# EAGLE schematic ESP_CO2_V0.30 (EAGLE 9.6.2)
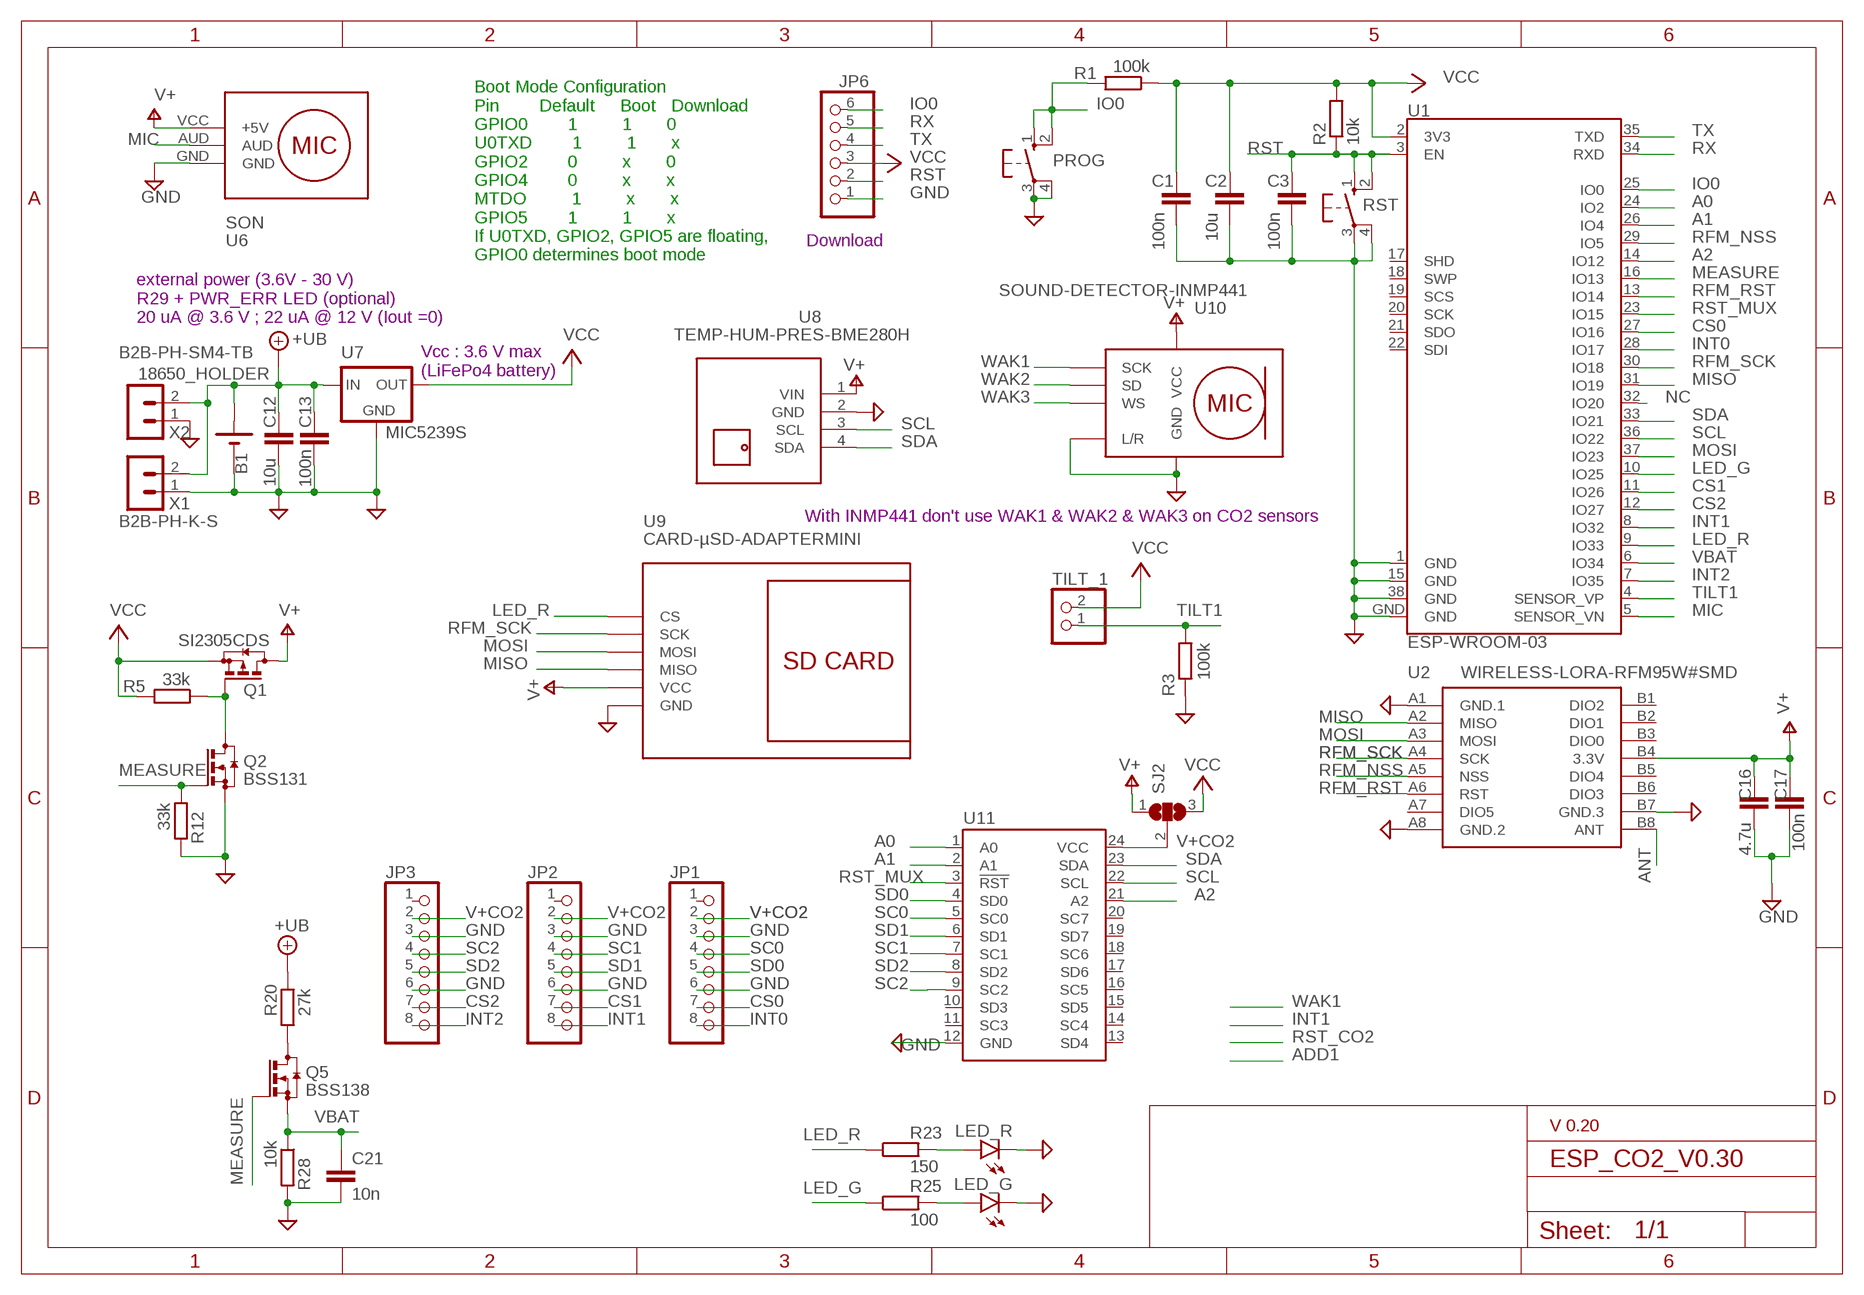
[diagram p0: schematic, sheet 1]

## Parts
B1  18650_HOLDER  [18650]
C1  100n  CC1206  [C1206]
C2  10u  CC1206  [C1206]
C3  100n  CC1206  [C1206]
C12  10u  CC1206  [C1206]
C13  100n  CC1206  [C1206]
C16  4.7u  CC1206  [C1206]
C17  100n  CC1206  [C1206]
C21  10n  CC1206  [C1206]
JP1  PINHD-1X8  [1X08]
JP2  PINHD-1X8  [1X08]
JP3  PINHD-1X8  [1X08]
JP6  PINHD-1X6/90  [1X06/90]
LED_G  LEDSML0805  [SML0805]
LED_R  LEDSML0805  [SML0805]
PROG  10-XX  [B3F-10XX]
Q1  SI2305CDS  [SOT23]
Q2  BSS131  [SOT23]
Q5  BSS138  [SOT23]
R1  100k  RR1206  [R1206]
R2  10k  RR1206  [R1206]
R3  100k  RR1206  [R1206]
R5  33k  RR1206  [R1206]
R12  33k  RR1206  [R1206]
R20  27k  RR1206  [R1206]
R23  150  RR1206  [R1206]
R25  100  RR1206  [R1206]
R28  10k  RR1206  [R1206]
RST  10-XX  [B3F-10XX]
SJ2  SJ2W  [SJ_2]
TILT_1  PINHD-1X2  [1X02]
U1  ESP-WROOM-03  [ESP-WROOM-03]
U2  WIRELESS-LORA-RFM95W#SMD  [WIRELESS-LORA-RFM95W#SMD]
U6  SON  [SON]
U7  MIC5239S  [SOT223]
U8  TEMP-HUM-PRES-BME280H  [TEMP-HUM-PRES-BME280-H]
U9  CARD-µSD-ADAPTERMINI  [CARD-MINI--µSD-READER]
U10  SOUND-DETECTOR-INMP441  [SOUND-DETECTOR-INMP441]
U11  PCA9548A  [TSSOP28]
X1  B2B-PH-K-S  [B2B-PH-K-S]
X2  B2B-PH-SM4-TB  [B2B-PH-SM4-TB]

## Nets
+UB: B1.+ C12.1 C13.1 R20.2 U7.1(IN) X1.2 X2.2
A0: U1.24(IO2) U11.1(A0)
A1: U1.26(IO4) U11.2(A1)
A2: U1.14(IO12) U11.21(A2)
ANT: U2.B8(ANT)
CS0: JP1.7 U1.27(IO16)
CS1: JP2.7 U1.11(IO26)
CS2: JP3.7 U1.12(IO27)
GND: B1.- C1.2 C2.2 C3.2 C12.2 C13.2 C16.2 C17.2 C21.2 JP1.3 JP1.6 JP2.3 JP2.6 JP3.3 JP3.6 JP6.1 LED_G.C LED_R.C PROG.3(P) PROG.4(P1) Q2.2(S) R3.2 R12.2 R28.2 RST.3(P) RST.4(P1) U1.1(GND) U1.15(GND) U1.38(GND) U1.GND U2.A1(GND.1) U2.A8(GND.2) U2.B7(GND.3) U6.GND U7.2(GND) U7.4(GND) U8.2(GND) U9.GND U10.GND U10.L/R U11.12(GND) X1.1 X2.1
INT0: JP1.8 U1.28(IO17)
INT1: JP2.8 U1.8(IO32)
INT2: JP3.8 U1.7(IO35)
IO0: JP6.6 PROG.1(S) PROG.2(S1) R1.2 U1.25(IO0)
LED_G: R25.1 U1.10(IO25)
LED_R: R23.1 U1.9(IO33) U9.CS
MEASURE: Q2.1(G) Q5.1(G) R12.1 U1.16(IO13)
MIC: U1.5(SENSOR_VN) U6.AUD
MISO: U1.31(IO19) U2.A2(MISO) U9.MISO
MOSI: U1.37(IO23) U2.A3(MOSI) U9.MOSI
N$1: Q1.1(G) Q2.3(D) R5.1
N$5: Q5.3(D) R20.1
N$7: LED_R.A R23.2
N$8: LED_G.A R25.2
NC: U1.32(IO20)
RFM_NSS: U1.29(IO5) U2.A5(NSS)
RFM_RST: U1.13(IO14) U2.A6(RST)
RFM_SCK: U1.30(IO18) U2.A4(SCK) U9.SCK
RST: C3.1 JP6.2 R2.1 RST.1(S) RST.2(S1) U1.3(EN)
RST_MUX: U1.23(IO15) U11.3(!RST)
RX: JP6.5 U1.34(RXD)
SC0: JP1.4 U11.5(SC0)
SC1: JP2.4 U11.7(SC1)
SC2: JP3.4 U11.9(SC2)
SCL: U1.36(IO22) U8.3(SCL) U11.22(SCL)
SD0: JP1.5 U11.4(SD0)
SD1: JP2.5 U11.6(SD1)
SD2: JP3.5 U11.8(SD2)
SDA: U1.33(IO21) U8.4(SDA) U11.23(SDA)
TILT1: R3.1 TILT_1.1 U1.4(SENSOR_VP)
TX: JP6.4 U1.35(TXD)
V+: C16.1 C17.1 Q1.3(D) SJ2.1 U2.B4(3.3V) U6.VCC(+5V) U8.1(VIN) U9.VCC U10.VDD(VCC)
V+CO2: JP1.2 JP2.2 JP3.2 SJ2.2 U11.24(VCC)
VBAT: C21.1 Q5.2(S) R28.1 U1.6(IO34)
VCC: C1.1 C2.1 JP6.3 Q1.2(S) R1.1 R2.2 R5.2 SJ2.3 TILT_1.2 U1.2(3V3) U7.3(OUT)
WAK1: U10.SCK
WAK2: U10.SD
WAK3: U10.WS
Unconnected: JP1.1 JP2.1 JP3.1 U1.17(SHD) U1.18(SWP) U1.19(SCS) U1.20(SCK) U1.21(SDO) U1.22(SDI) U2.A7(DIO5) U2.B1(DIO2) U2.B2(DIO1) U2.B3(DIO0) U2.B5(DIO4) U2.B6(DIO3) U11.10(SD3) U11.11(SC3) U11.13(SD4) U11.14(SC4) U11.15(SD5) U11.16(SC5) U11.17(SD6) U11.18(SC6) U11.19(SD7) U11.20(SC7)

## Notes on the sheet
- Download
- Boot Mode Configuration
  Pin        Default     Boot   Download
  GPIO0        1         1       0
  U0TXD        1         1       x
  GPIO2        0         x       0
  GPIO4        0         x       x
  MTDO         1         x       x
  GPIO5        1         1       x
  If U0TXD, GPIO2, GPIO5 are floating, 
  GPIO0 determines boot mode
- external power (3.6V - 30 V)
  R29 + PWR_ERR LED (optional)
  20 uA @ 3.6 V ; 22 uA @ 12 V (Iout =0)
- Vcc : 3.6 V max 
  (LiFePo4 battery)
- With INMP441 don't use WAK1 & WAK2 & WAK3 on CO2 sensors
- V 0.20

## Library data of the parts
B1 = battery_bms:18650_HOLDER: 18650 holder
C1-C3 C12 C13 C16 C17 C21 = eagle-ltspice:C: CAPACITOR, European symbol; SPICEMODEL: NONE; SPICEPREFIX: C
JP1-JP3 = pinhead:PINHD-1X8: PIN HEADER
JP6 = pinhead:PINHD-1X6: PIN HEADER
LED_G LED_R = led:LED: LED OSRAM: - CHIPLED LG R971, LG N971, LY N971, LG Q971, LY Q971, LO R971, LY R971 LH N974, LH R974 LS Q976, LO Q976, LY Q976 LO Q996 - Hyper CHIPLED LW Q18S LB Q993, LB Q99A, LB R99A - SideLED LS A670, LO A670, LY A670, LG A670, LP A670 LB A673, LV A673, LT A673, LW A673 LH A674 LY A675 LS A676, LA A676, LO A676, LY A676, LW A676 LS A679, LY A679, LG A679 - Hyper Micro SIDELED® LS Y876, LA Y876, LO Y876, LY Y876 LT Y87S - SmartLED LW L88C, LW L88S LB L89C, LB L89S, LG L890 LS L89K, LO L89K, LY L89K LS L896, LA L896, LO L896, LY L896 - TOPLED LS T670, LO T670, LY T670, LG T670, LP T670 LSG T670, LSP T670, LSY T670, LOP T670, LYG T670 LG T671, LOG T671, LSG T671 LB T673, LV T673, LT T673, LW T673 LH T674 LS T676, LA T676, LO T676, LY T676, LB T676, LH T676, LSB T676, LW T676 LB T67C, LV T67C, LT T67C, LS T67K, LO T67K, LY T67K, LW E67C LS E67B, LA E67B, LO E67B, LY E67B, LB E67C, LV E67C, LT E67C LW T67C LS T679, LY T679, LG T679 LS T770, LO T770, LY T770, LG T770, LP T770 LB T773, LV T773, LT T773, LW T773 LH T774 LS E675, LA E675, LY E675, LS T675 LS T776, LA T776, LO T776, LY T776, LB T776 LHGB T686 LT T68C, LB T68C - Hyper Mini TOPLED® LB M676 - Mini TOPLED Santana® LG M470 LS M47K, LO M47K, LY M47K Source: http://www.osram.convergy.de LUXEON: - LUMILED® LXK2-PW12-R00, LXK2-PW12-S00, LXK2-PW14-U00, LXK2-PW14-V00 LXK2-PM12-R00, LXK2-PM12-S00, LXK2-PM14-U00 LXK2-PE12-Q00, LXK2-PE12-R00, LXK2-PE12-S00, LXK2-PE14-T00, LXK2-PE14-U00 LXK2-PB12-K00, LXK2-PB12-L00, LXK2-PB12-M00, LXK2-PB14-N00, LXK2-PB14-P00, LXK2-PB14-Q00 LXK2-PR12-L00, LXK2-PR12-M00, LXK2-PR14-Q00, LXK2-PR14-R00 LXK2-PD12-Q00, LXK2-PD12-R00, LXK2-PD12-S00 LXK2-PH12-R00, LXK2-PH12-S00 LXK2-PL12-P00, LXK2-PL12-Q00, LXK2-PL12-R00 Source: www.luxeon.com KINGBRIGHT: KA-3528ASYC Source: www.kingbright.com
PROG RST = switch-omron:10-XX: OMRON SWITCH; MPN: B3F-1000; OC_FARNELL: 176432; OC_NEWARK: 36M3542
Q1 = transistor-small-signal-perso:SI2305CDS: P-CHANNEL MOS FET
Q2 = transistor-small-signal-perso:BSS131: N-CHANNEL MOS FET
Q5 = detect:BSS138: N-CHANNEL MOS FET
R1-R3 R5 R12 R20 R23 R25 R28 = eagle-ltspice:R: RESISTOR, European symbol; SPICEMODEL: NONE; SPICEPREFIX: R
SJ2 = jumper:SJ2W: SMD solder JUMPER
TILT_1 = pinhead:PINHD-1X2: PIN HEADER
U1 = esp32-sparkfun (1):ESP-WROOM-03; OC_FARNELL: unknown
U2 = diy-modules:WIRELESS-LORA-RFM95W: 868/915 MHz LoRa Radio Transceiver Module based on SX1276 chip Click here to find device on ebay.com <http://www.ebay.com/sch/RFM95W+transceiver>
U6 = diy-modules:SON: Sound Detection Module
U7 = micrel:MIC5239S: LDO REGULATOR
U8 = diy-modules1.8-perso:TEMP-HUM-PRES-BME280: Digital Humidity-Temperature-Pressure Sensor based on BME280 device More information about BME280 device is available here: https://www.bosch-sensortec.com/bst/products/all_products/bme280 Click here to find device on ebay.com <http://www.ebay.com/sch/bme280+breakout>
U9 = diy-modules1.8-perso:CARD-µSD-ADAPTER: Full Size SD Card Adapter Module with onboard 3.3V regulator
U10 = diy-modules1.8-perso:SOUND-DETECTOR-INMP441: SOUND DETCETOR INMP441
U11 = SparkFun-IC-Logic (1):PCA9548A: Texas Instruments PCA9548A - I2C Multiplexer The PCA9548A device has eight bidirectional translating switches that can be controlled through the I2C bus. The SCL/SDA upstream pair fans out to eight downstream pairs, or channels. Any individual SCn/SDn channel or combination of channels can be selected, determined by the contents of the programmable control register. These downstream channels can be used to resolve I2C slave address conflicts.; PROD_ID: IC-13948
X1 X2 = con-JST PH:B2B-PH: JST PH series header 2.00mm pitch disconnectable crimp style connectors, vertical (side entry type), 2 pins